# EasyEDA schematic SCH_milkv-extension-board_2024-06-30.json
TITLE: Sheet_1; REV: 1.0; Date: 2024-06-28; Sheet: 1/1; Drawn By: liketoengineer; Company: Your Company
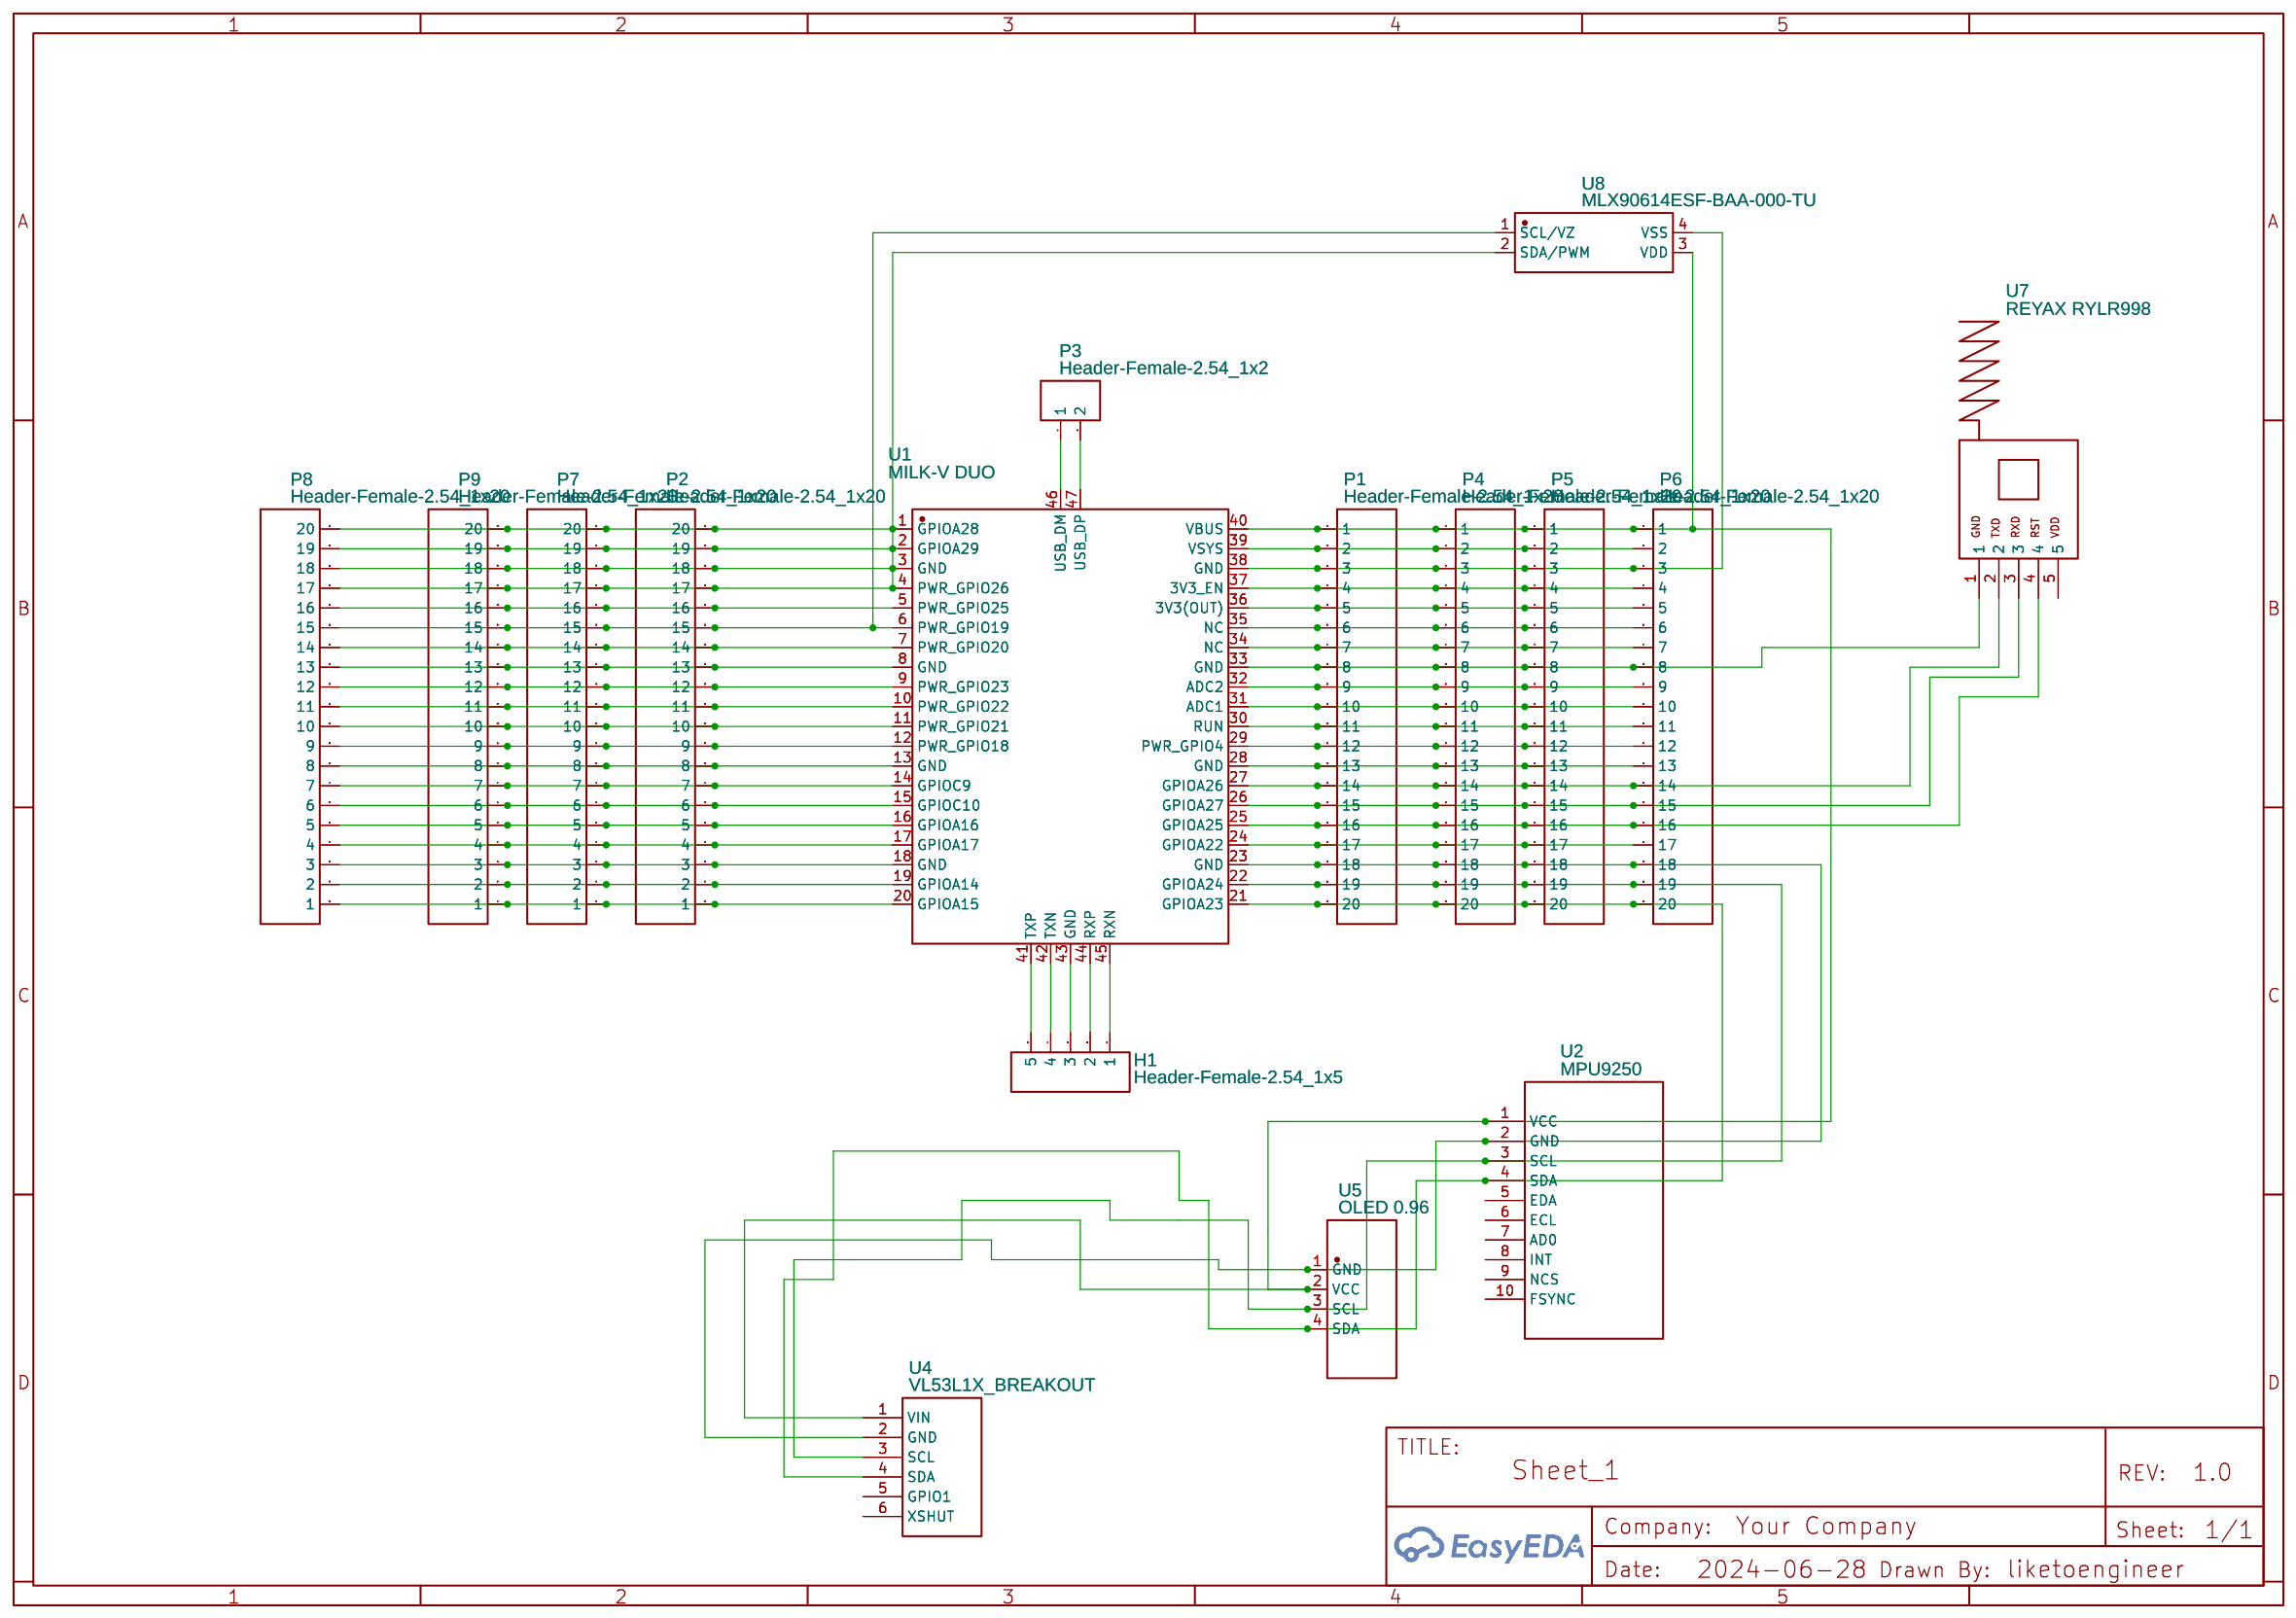
[diagram p0: schematic sheet]

## Parts
H1  Header-Female-2.54_1x5  [HDR-TH_5P-P2.54-V-F]
P1  Header-Female-2.54_1x20  [HDR-TH_20P-P2.54-V-F]
P2  Header-Female-2.54_1x20  [HDR-TH_20P-P2.54-V-F]
P3  Header-Female-2.54_1x2  [HDR-TH_2P-P2.54-V-F]
P4  Header-Female-2.54_1x20  [HDR-TH_20P-P2.54-V-F]
P5  Header-Female-2.54_1x20  [HDR-TH_20P-P2.54-V-F]
P6  Header-Female-2.54_1x20  [HDR-TH_20P-P2.54-V-F]
P7  Header-Female-2.54_1x20  [HDR-TH_20P-P2.54-V-F]
P8  Header-Female-2.54_1x20  [HDR-TH_20P-P2.54-V-F]
P9  Header-Female-2.54_1x20  [HDR-TH_20P-P2.54-V-F]
U1  MILK-V DUO  [COMM-SMD_L51.0-W21.0-P2.54-MILK-VDUO]
U2  MPU9250  [MPU9250]
U4  VL53L1X_BREAKOUT  [VL53L1X_BREAKOUT]
U5  OLED 0.96  [OLED-TH_OLED0.96-SPI]
U7  REYAX RYLR998  [RYLR998]
U8  MLX90614ESF-BAA-000-TU  [TO-39-4_MELEXIS_MLX90614XXA]

## Library data of the parts
H1 = Header-Female-2.54_1x5: Supplier: LCSC; Manufacturer: BOOMELE(博穆精密); Manufacturer Part: 2.54-1*5P母; Supplier Part: C50950; JLCPCB Part Class: Extended Part
P1 P2 P4-P9 = Header-Female-2.54_1x20: Supplier: LCSC; Manufacturer: BOOMELE(博穆精密); Manufacturer Part: 2.54-1*20P母; Supplier Part: C50984; JLCPCB Part Class: Extended Part
P3 = Header-Female-2.54_1x2: Supplier: LCSC; Manufacturer: BOOMELE(博穆精密); Manufacturer Part: 2.54-1*2P母; Supplier Part: C49661; JLCPCB Part Class: Extended Part
U1 = MILK-V DUO: Supplier: LCSC; Supplier Part: C9900057620; Manufacturer: null; Manufacturer Part: Milk-V Duo; Contributor: lcsc
U2 = MPU9250: Contributor: thihan
U4 = VL53L1X_BREAKOUT: Manufacturer Part: VL53L0X Time-of-Flight Distance Sensor VL53L0X; Contributor: freddyka
U5 = OLED 0.96: Supplier: LCSC; Supplier Part: C9900027058; Manufacturer: 郑州中景园电子技术有限公司; Manufacturer Part: ZJY096S0700BG01蓝色; link: https://img.jlc.com/pdf/applyPasteComponent/2022-08-15/203417A/337c2d88c1b34c958220578f8c1ccd46/ZJY096S0700WG01.pdf; Contributor: alex_petrovich
U7 = REYAX RYLR998: Manufacturer: REYAX; Contributor: Christian Bodington
U8 = MLX90614ESF-BAA-000-TU: Contributor: lcsc; Supplier: LCSC; Supplier Part: C490604; Manufacturer: Melexis(比利时迈来芯); JLCPCB Part Class: Extended Part

## Nets
Net-(H1-1): H1.1 U1.45(RXN)
Net-(H1-2): H1.2 U1.44(RXP)
Net-(H1-3): H1.3 U1.43(GND)
Net-(H1-4): H1.4 U1.42(TXN)
Net-(H1-5): H1.5 U1.41(TXP)
Net-(P1-1): P1.1 P4.1 P5.1 P6.1 U1.40(VBUS) U2.1(VCC) U4.1(VIN) U5.2(VCC) U8.3(VDD)
Net-(P1-2): P1.2 P4.2 P5.2 P6.2 U1.39(VSYS)
Net-(P1-3): P1.3 P4.3 P5.3 P6.3 U1.38(GND) U8.4(VSS)
Net-(P1-4): P1.4 P4.4 P5.4 P6.4 U1.37(3V3_EN)
Net-(P1-5): P1.5 P4.5 P5.5 P6.5 U1.36(3V3(OUT))
Net-(P1-6): P1.6 P4.6 P5.6 P6.6 U1.35(NC)
Net-(P1-7): P1.7 P4.7 P5.7 P6.7 U1.34(NC)
Net-(P1-8): P1.8 P4.8 P5.8 P6.8 U1.33(GND) U7.1
Net-(P1-9): P1.9 P4.9 P5.9 P6.9 U1.32(ADC2)
Net-(P1-10): P1.10 P4.10 P5.10 P6.10 U1.31(ADC1)
Net-(P1-11): P1.11 P4.11 P5.11 P6.11 U1.30(RUN)
Net-(P1-12): P1.12 P4.12 P5.12 P6.12 U1.29(PWR_GPIO4)
Net-(P1-13): P1.13 P4.13 P5.13 P6.13 U1.28(GND)
Net-(P1-14): P1.14 P4.14 P5.14 P6.14 U1.27(GPIOA26) U7.2
Net-(P1-15): P1.15 P4.15 P5.15 P6.15 U1.26(GPIOA27) U7.3
Net-(P1-16): P1.16 P4.16 P5.16 P6.16 U1.25(GPIOA25) U7.4
Net-(P1-17): P1.17 P4.17 P5.17 P6.17 U1.24(GPIOA22)
Net-(P1-18): P1.18 P4.18 P5.18 P6.18 U1.23(GND) U2.2(GND) U4.2(GND) U5.1(GND)
Net-(P1-19): P1.19 P4.19 P5.19 P6.19 U1.22(GPIOA24) U2.3(SCL) U4.3(SCL) U5.3(SCL)
Net-(P1-20): P1.20 P4.20 P5.20 P6.20 U1.21(GPIOA23) U2.4(SDA) U4.4(SDA) U5.4(SDA)
Net-(P2-1): P2.1 P7.1 P8.1 P9.1 U1.20(GPIOA15)
Net-(P2-2): P2.2 P7.2 P8.2 P9.2 U1.19(GPIOA14)
Net-(P2-3): P2.3 P7.3 P8.3 P9.3 U1.18(GND)
Net-(P2-4): P2.4 P7.4 P8.4 P9.4 U1.17(GPIOA17)
Net-(P2-5): P2.5 P7.5 P8.5 P9.5 U1.16(GPIOA16)
Net-(P2-6): P2.6 P7.6 P8.6 P9.6 U1.15(GPIOC10)
Net-(P2-7): P2.7 P7.7 P8.7 P9.7 U1.14(GPIOC9)
Net-(P2-8): P2.8 P7.8 P8.8 P9.8 U1.13(GND)
Net-(P2-9): P2.9 P7.9 P8.9 P9.9 U1.12(PWR_GPIO18)
Net-(P2-10): P2.10 P7.10 P8.10 P9.10 U1.11(PWR_GPIO21)
Net-(P2-11): P2.11 P7.11 P8.11 P9.11 U1.10(PWR_GPIO22)
Net-(P2-12): P2.12 P7.12 P8.12 P9.12 U1.9(PWR_GPIO23)
Net-(P2-13): P2.13 P7.13 P8.13 P9.13 U1.8(GND)
Net-(P2-14): P2.14 P7.14 P8.14 P9.14 U1.7(PWR_GPIO20)
Net-(P2-15): P2.15 P7.15 P8.15 P9.15 U1.6(PWR_GPIO19) U8.1(SCL/VZ)
Net-(P2-16): P2.16 P7.16 P8.16 P9.16 U1.5(PWR_GPIO25)
Net-(P2-17): P2.17 P2.18 P2.19 P2.20 P7.17 P7.18 P7.19 P7.20 P8.17 P8.18 P8.19 P8.20 P9.17 P9.18 P9.19 P9.20 U1.1(GPIOA28) U1.2(GPIOA29) U1.3(GND) U1.4(PWR_GPIO26) U8.2(SDA/PWM)
Net-(P3-1): P3.1 U1.46(USB_DM)
Net-(P3-2): P3.2 U1.47(USB_DP)

Not connected (* = marked no-connect by the designer): U2 5(EDA) 6(ECL) 7(AD0) 8(INT) 9(NCS) 10(FSYNC); U4 5(GPIO1) 6(XSHUT); U7 5
